# Altium schematic sheet Howland.SchDoc
size A4; SheetNumber: 6; SheetTotal: 6
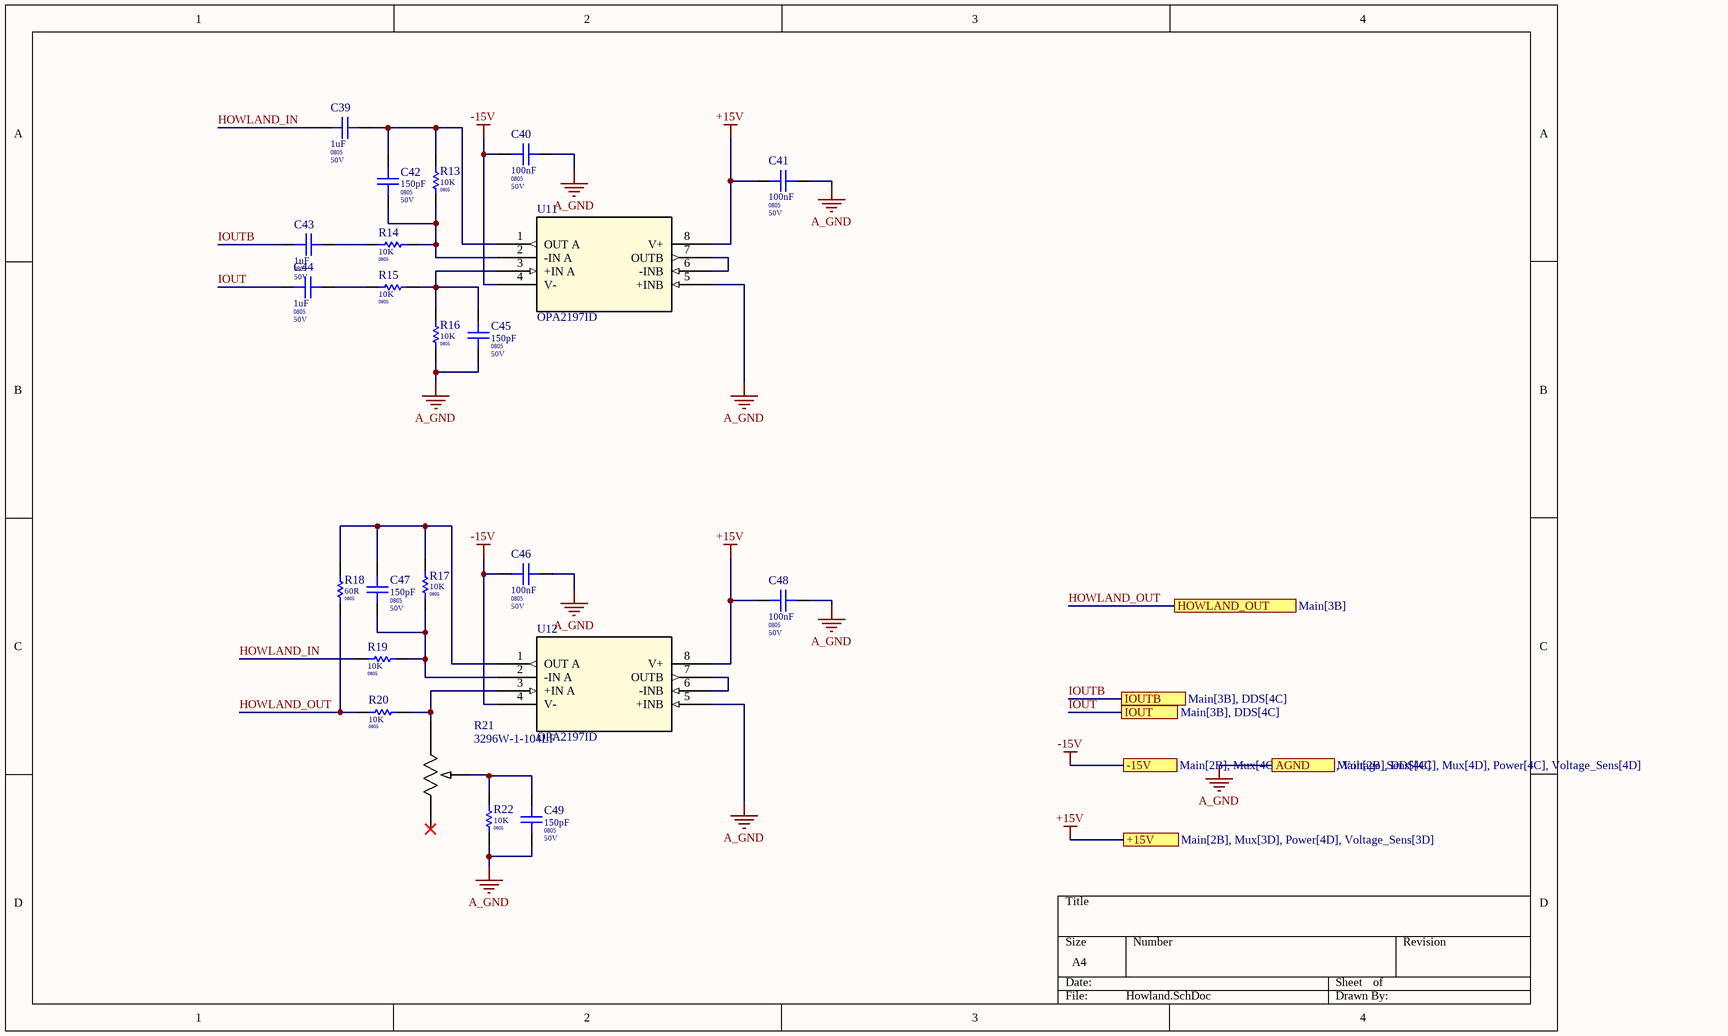
[diagram p0: Howland.SchDoc]

## Parts
C39  Package / Case: 0805  Voltage: 50V  [CAPC 0805]  (hidden comment: 1uF)
C40  Package / Case: 0805  Voltage: 50V  [CAPC 0805]  (hidden comment: 100nF)
C41  Package / Case: 0805  Voltage: 50V  [CAPC 0805]  (hidden comment: 100nF)
C42  Package / Case: 0805  Voltage: 50V  [CAPC 0805]  (hidden comment: 150pF)
C43  Package / Case: 0805  Voltage: 50V  [CAPC 0805]  (hidden comment: 1uF)
C44  Package / Case: 0805  Voltage: 50V  [CAPC 0805]  (hidden comment: 1uF)
C45  Package / Case: 0805  Voltage: 50V  [CAPC 0805]  (hidden comment: 150pF)
C46  Package / Case: 0805  Voltage: 50V  [CAPC 0805]  (hidden comment: 100nF)
C47  Package / Case: 0805  Voltage: 50V  [CAPC 0805]  (hidden comment: 150pF)
C48  Package / Case: 0805  Voltage: 50V  [CAPC 0805]  (hidden comment: 100nF)
C49  Package / Case: 0805  Voltage: 50V  [CAPC 0805]  (hidden comment: 150pF)
R13  Package / Case: 0805  [RESC 0805]  (hidden comment: 10K)
R14  Package / Case: 0805  [RESC 0805]  (hidden comment: 10K)
R15  Package / Case: 0805  [RESC 0805]  (hidden comment: 10K)
R16  Package / Case: 0805  [RESC 0805]  (hidden comment: 10K)
R17  Package / Case: 0805  [RESC 0805]  (hidden comment: 10K)
R18  Package / Case: 0805  [RESC 0805]  (hidden comment: 60R)
R19  Package / Case: 0805  [RESC 0805]  (hidden comment: 10K)
R20  Package / Case: 0805  [RESC 0805]  (hidden comment: 10K)
R21  3296W-1-104LF  [POT_3296W]
R22  Package / Case: 0805  [RESC 0805]  (hidden comment: 10K)
U11  OPA2197ID  [D8_TEX-M]
U12  OPA2197ID  [D8_TEX-M]

## Ports
+15V (see Main[2B], Mux[3D], Power[4D], Voltage_Sens[3D]), -15V (see Main[2B], Mux[4C], Power[4C], Voltage_Sens[4C]), AGND (see Main[2B], DDS[4C], Mux[4D], Power[4C], Voltage_Sens[4D]), HOWLAND_OUT (see Main[3B]), IOUT (see Main[3B], DDS[4C]), IOUTB (see Main[3B], DDS[4C])

## Nets
+15V: C41.2 C48.2 U11.8(V+) U12.8(V+) ; port +15V
-15V: C40.2 C46.2 U11.4(V-) U12.4(V-) ; port -15V
A_GND: C40.1 C41.1 C45.1 C46.1 C48.1 C49.1 R16.2 R22.2 U11.5(+INB) U12.5(+INB) ; port AGND
HOWLAND_IN: C39.1 R19.1
HOWLAND_OUT: R18.1 R20.1 ; port HOWLAND_OUT
IOUT: C44.1 ; port IOUT
IOUTB: C43.1 ; port IOUTB
NetC39_2: C39.2 C42.2 R13.1 U11.1(OUT_A)
NetC42_1: C42.1 R13.2 R14.1 U11.2(-IN_A)
NetC43_2: C43.2 R14.2
NetC44_2: C44.2 R15.2
NetC45_2: C45.2 R15.1 R16.1 U11.3(+IN_A)
NetC47_1: C47.1 R17.2 R19.2 U12.2(-IN_A)
NetC47_2: C47.2 R17.1 R18.2 U12.1(OUT_A)
NetC49_2: C49.2 R21.2 R22.1
NetR20_2: R20.2 R21.1 U12.3(+IN_A)
NetU11_6: U11.6(-INB) U11.7(OUTB)
NetU12_6: U12.6(-INB) U12.7(OUTB)

Not connected (* = marked no-connect by the designer): R21 3*

## Library data of the parts
C39 C43 C44 = CAPC0580: Capacitor Ceramic 1uF 50V 0805; Tolerance: %10; Value Rating: uF; Values: 1uF 50V; Favorites: Favorite; Value: 1uF; Part Number: CAPC0580; Category: Capacitor Ceramic
C40 C41 C46 C48 = CAPC0572: Capacitor Ceramic 100nF 50V 0805; Tolerance: %10; Value Rating: nF; Favorites: Favorite; Value: 100nF; Part Number: CAPC0572; Category: Capacitor Ceramic; Values: 100nF 50V
C42 C45 C47 C49 = CAPC0549: Capacitor Ceramic 150pF 50V 0805; Tolerance: %10; Value Rating: pF; Value: 150pF; Part Number: CAPC0549; Category: Capacitor Ceramic; Values: 150pF 50V
R13-R17 R19 R20 R22 = R0366: 10K 0805; Part Number: R0366; Tolerance: %5; Power: 1/10W; Value: 10K; Category: Resistor; Values: 10K
R18 = R0323: 160R 0805; Part Number: R0323; Tolerance: %5; Power: 1/10W; Value: 60R; Category: Resistor; Values: 160R
R21 = 3296W-1-104LF: Description; Manufacturer_Name: Bourns Electronics; Copyright: Copyright (C) 2025 Ultra Librarian. All rights reserved.; Manufacturer_Part_Number: 3296W-1-104LF
U11 U12 = OPA2197ID: Dual 36-V, precision, rail-to-rail input output, low offset voltage op amp 8-SOIC -40 to 125; Manufacturer_Name: Texas Instruments; Copyright: Copyright (C) 2025 Ultra Librarian. All rights reserved.; Manufacturer_Part_Number: OPA2197ID; RefDes: RefDes; Type: Type